# Altium project MADI_STM32G4_PCB.PrjPcb
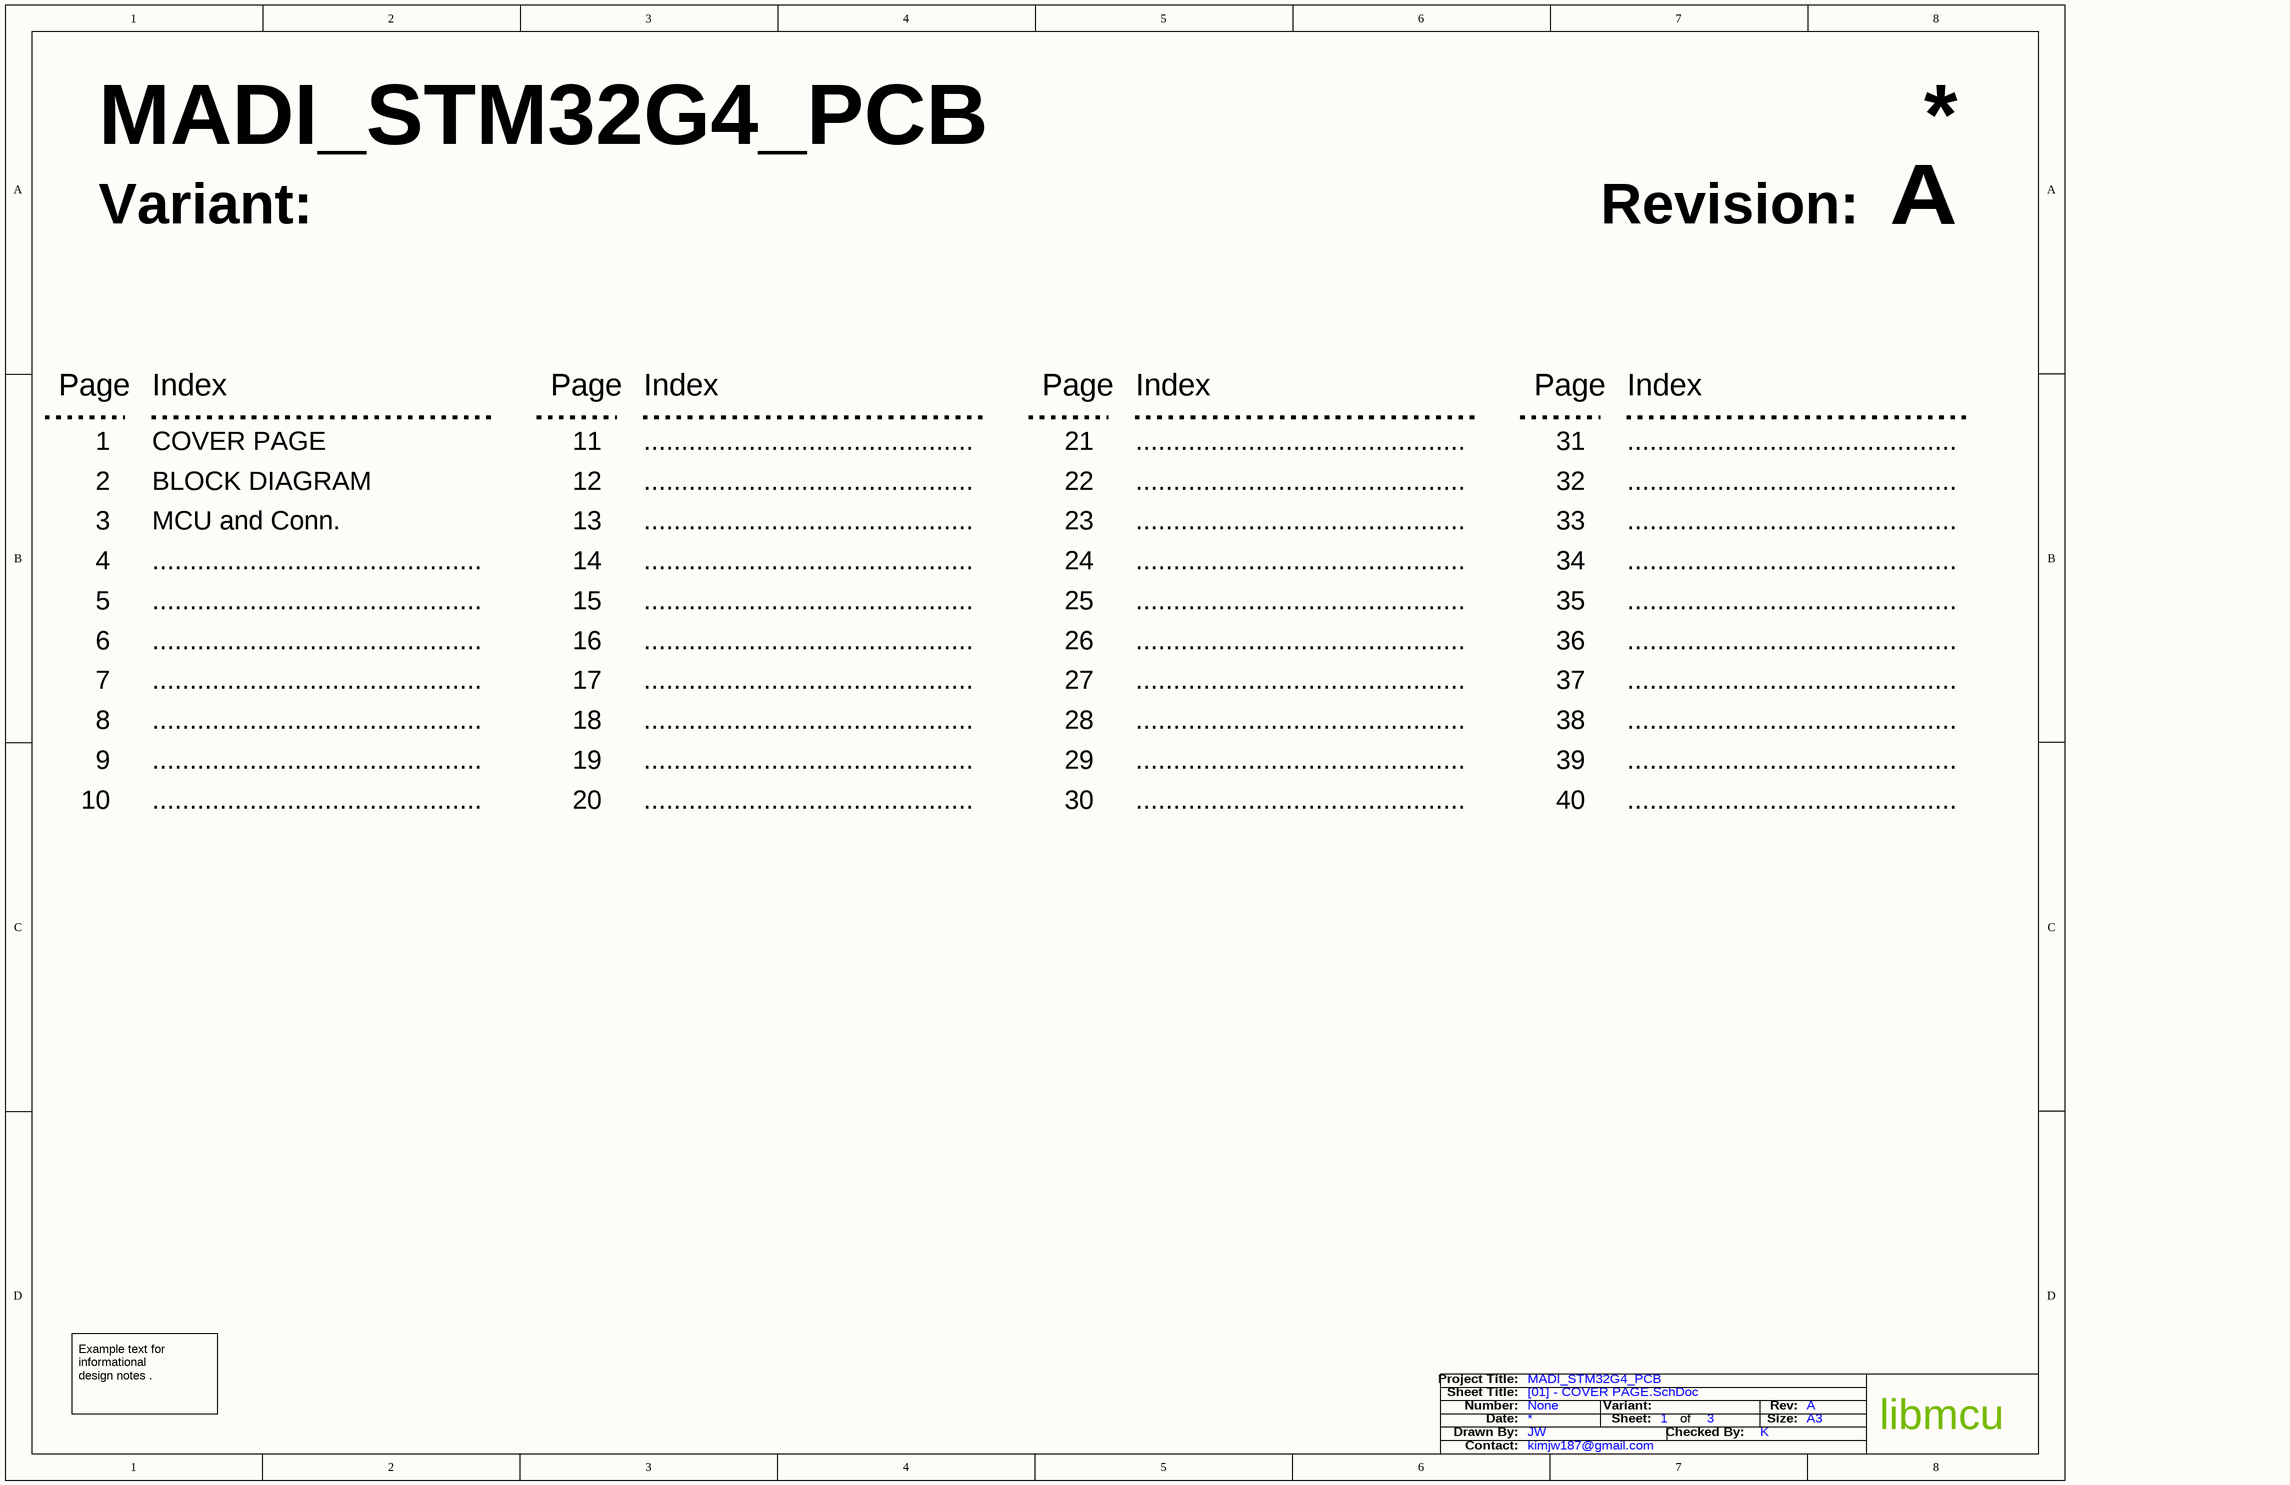
[diagram p0: [01] - COVER PAGE.SchDoc]
VersionRevision: A; SheetSize: A3; ProjectNumber: None; Project: MADI_STM32G4_PCB; DrawnBy: JW; Contact: kimjw187@gmail.com; Company: libmcu; CheckedBy: K; Address2: -; Address1: -
3 sheets, 52 parts. Net scope: global (net labels, ports and power ports of the same name join across sheets).
Board file: MADI_STM32G4_PCB_L4.PcbDoc
Sheets:
  [01] - COVER PAGE.SchDoc
  [02] - BLOCK DIAGRAM.SchDoc
  [03] - MCU and Conn.SchDoc

## Sheet [01] - COVER PAGE.SchDoc
size A3; DocumentNumber: 1; SheetNumber: 1; SheetTotal: 3

### Notes on the sheet
- Variant:
- Revision:
- Page
- Index
- 1
- 2
- COVER PAGE
- BLOCK DIAGRAM
- 11
- 12
- ............................................
- 21
- 22
- 31
- 32
- 3
- 4
- MCU and Conn.
- 13
- 14
- 23
- 24
- 33
- 34
- 5
- 15
- 25
- 35
- 6
- 7
- 16
- 17
- 26
- 27
- 36
- 37
- 8
- 9
- 18
- 19
- 28
- 29
- 38
- 39
- 10
- 20
- 30
- 40
- Example text for informational
  design notes .
- Project Title:
- Number:
- Date:
- Sheet Title:
- Drawn By:
- Sheet:
- of
- Checked By:
- Rev:
- Size:
- libmcu
- Contact:

## Sheet [02] - BLOCK DIAGRAM.SchDoc
size A3; DocumentNumber: 2; SheetNumber: 2; SheetTotal: 3

### Notes on the sheet
- Project Title:
- Number:
- Date:
- Sheet Title:
- Drawn By:
- Sheet:
- Variant:
- of
- Checked By:
- Rev:
- Size:
- libmcu
- Contact:
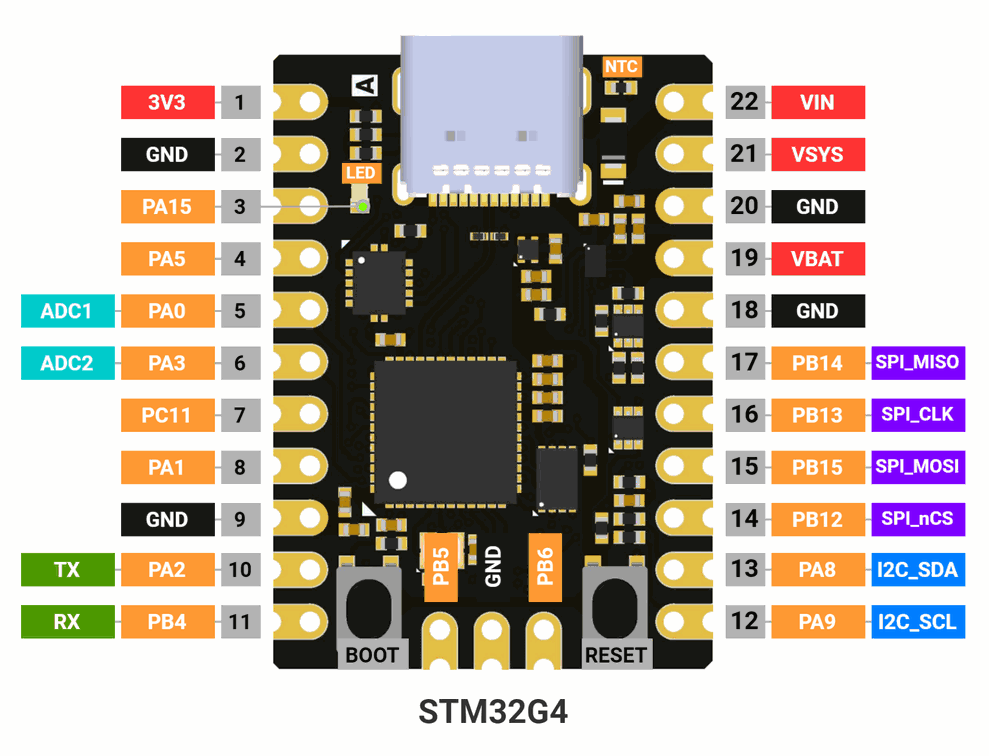
[diagram p1: [02] - BLOCK DIAGRAM.SchDoc]

## Sheet [03] - MCU and Conn.SchDoc
size A3; DocumentNumber: 3; SheetNumber: 3; SheetTotal: 3
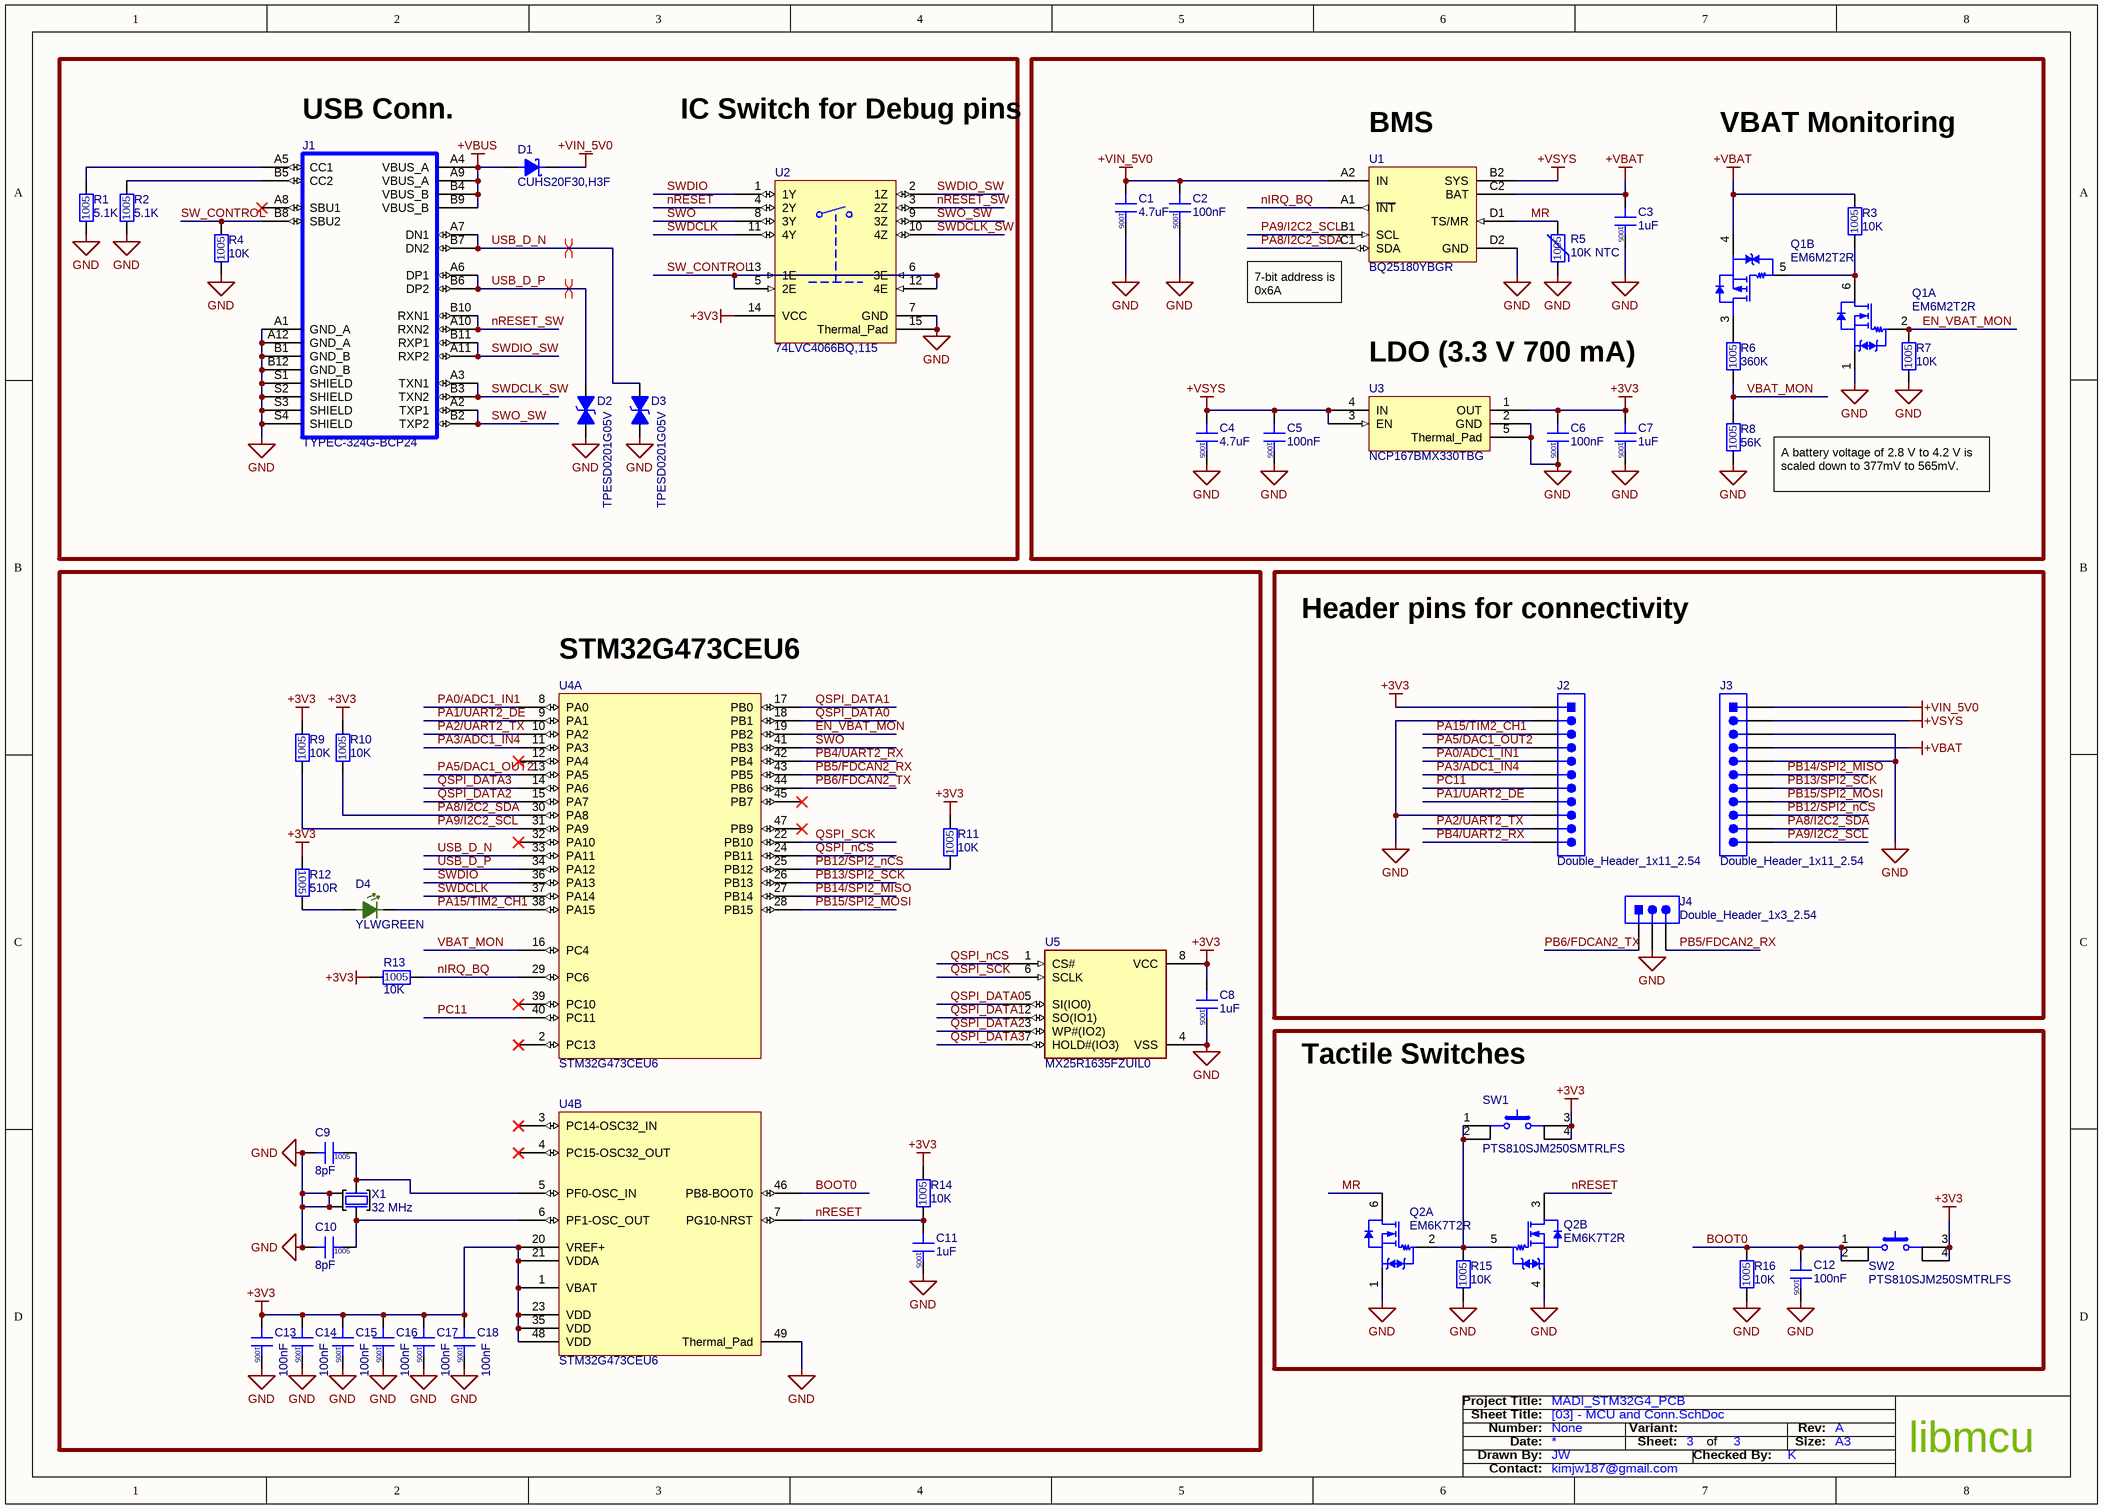
[diagram p2: [03] - MCU and Conn.SchDoc]

### Parts
C1  4.7uF  [CAPC1005X06N]
C2  100nF  [CAPC1005X06N]
C3  1uF  [CAPC1005X06N]
C4  4.7uF  [CAPC1005X06N]
C5  100nF  [CAPC1005X06N]
C6  100nF  [CAPC1005X06N]
C7  1uF  [CAPC1005X06N]
C8  1uF  [CAPC1005X06N]
C9  8pF  [CAPC1005X06N]
C10  8pF  [CAPC1005X06N]
C11  1uF  [CAPC1005X06N]
C12  100nF  [CAPC1005X06N]
C13  100nF  [CAPC1005X06N]
C14  100nF  [CAPC1005X06N]
C15  100nF  [CAPC1005X06N]
C16  100nF  [CAPC1005X06N]
C17  100nF  [CAPC1005X06N]
C18  100nF  [CAPC1005X06N]
D1  CUHS20F30,H3F  [US2H-DIODE]
D2  TPESD0201G05V  [DIOC0603X03N]
D3  TPESD0201G05V  [DIOC0603X03N]
D4  YLWGREEN  [LDIOC1608X08N]
J1  TYPEC-324G-BCP24  [KUSBX-SMT3-CS-BTR_KYC]
J2  Double_Header_1x11_2.54  [1x11_DOUBLE_HEADER_2.54]  (no BOM)
J3  Double_Header_1x11_2.54  [1x11_DOUBLE_HEADER_2.54]  (no BOM)
J4  Double_Header_1x3_2.54  [1x3_DOUBLE_HEADER_2.54]  (no BOM)
Q1  EM6M2T2R  [SOTFL50P160X55-6N]  (parts A,B of 2)
Q2  EM6K7T2R  [SOTFL50P160X55-6N]  (parts A,B of 2)
R1  5.1K  [RESC1005X04N]
R2  5.1K  [RESC1005X04N]
R3  10K  [RESC1005X04N]
R4  10K  [RESC1005X04N]
R5  10K NTC  [NTC1005X05N]
R6  360K  [RESC1005X04N]
R7  10K  [RESC1005X04N]
R8  56K  [RESC1005X04N]
R9  10K  [RESC1005X04N]
R10  10K  [RESC1005X04N]
R11  10K  [RESC1005X04N]
R12  510R  [RESC1005X04N]
R13  10K  [RESC1005X04N]
R14  10K  [RESC1005X04N]
R15  10K  [RESC1005X04N]
R16  10K  [RESC1005X04N]
SW1  PTS810SJM250SMTRLFS  [PTS810]
SW2  PTS810SJM250SMTRLFS  [PTS810]
U1  BQ25180YBGR  [BGA8C40P2X4_100X155X50_YBG0008]
U2  74LVC4066BQ,115  [QFN50P250X300X100_HS-15N]
U3  NCP167BMX330TBG  [NCP167]
U4  STM32G473CEU6  [QFN50P700X700X60_HS-49N]  (parts A,B of 2)
U5  MX25R1635FZUIL0  [USON8_3X2]
X1  32 MHz  [XT2016_ECS]

### Blocks framed on the sheet
STM32G473CEU6: C8-C11 C13-C18 D4 R9-R14 U4 U5 X1
Header pins for connectivity: J2-J4
Tactile Switches: C12 Q2 R15 R16 SW1 SW2

### Nets
+3V3: C6.2 C7.2 C8.2 C13.2 C14.2 C15.2 C16.2 C17.2 C18.2 J2.1 R9.2 R10.2 R11.2 R12.2 R13.1 R14.2 SW1.3 SW1.4 SW2.3 SW2.4 U2.14(VCC) U3.1(OUT) U4.1(VBAT) U4.20(VREF+) U4.21(VDDA) U4.23(VDD) U4.35(VDD) U4.48(VDD) U5.8(VCC)
+VBAT: C3.2 J3.4 Q1.4(S) R3.2 U1.C2(BAT)
+VBUS: D1.2(Anode) J1.A4(VBUS_A) J1.A9(VBUS_A) J1.B4(VBUS_B) J1.B9(VBUS_B)
+VIN_5V0: C1.2 C2.2 D1.1(Cathode) J3.1 U1.A2(IN)
+VSYS: C4.2 C5.2 J3.2 U1.B2(SYS) U3.3(EN) U3.4(IN)
GND: C1.1 C2.1 C3.1 C4.1 C5.1 C6.1 C7.1 C8.1 C9.2 C10.2 C11.1 C12.1 C13.1 C14.1 C15.1 C16.1 C17.1 C18.1 D2.2 D3.2 J1.A1(GND_A) J1.A12(GND_A) J1.B1(GND_B) J1.B12(GND_B) J1.S1(SHIELD) J1.S2(SHIELD) J1.S3(SHIELD) J1.S4(SHIELD) J2.2 J2.9 J3.3 J3.5 J4.2 Q1.1(S) Q2.1(S) Q2.4(S) R1.1 R2.1 R4.1 R5.1 R7.1 R8.1 R15.1 R16.1 U1.D2(GND) U2.7(GND) U2.15(Thermal_Pad) U3.2(GND) U3.5(Thermal_Pad) U4.49(Thermal_Pad) U5.4(VSS) X1.2(GND) X1.4(GND)
BOOT0: C12.2 R16.2 SW2.1 SW2.2 U4.46(PB8-BOOT0)
EN_VBAT_MON: Q1.2(G) R7.2 U4.19(PB2)
MR: Q2.6(D) R5.2 U1.D1(TS/MR)
nIRQ_BQ: R13.2 U1.A1(~{INT}) U4.29(PC6)
nRESET: C11.2 Q2.3(D) R14.1 U2.4(2Y) U4.7(PG10-NRST)
nRESET_SW: J1.A10(RXN2) J1.B10(RXN1) U2.3(2Z)
PA0/ADC1_IN1: J2.5 U4.8(PA0)
PA1/UART2_DE: J2.8 U4.9(PA1)
PA2/UART2_TX: J2.10 U4.10(PA2)
PA3/ADC1_IN4: J2.6 U4.11(PA3)
PA5/DAC1_OUT2: J2.4 U4.13(PA5)
PA8/I2C2_SDA: J3.10 R10.1 U1.C1(SDA) U4.30(PA8)
PA9/I2C2_SCL: J3.11 R9.1 U1.B1(SCL) U4.31(PA9)
PA15/TIM2_CH1: D4.K J2.3 U4.38(PA15)
PB4/UART2_RX: J2.11 U4.42(PB4)
PB5/FDCAN2_RX: J4.3 U4.43(PB5)
PB6/FDCAN2_TX: J4.1 U4.44(PB6)
PB12/SPI2_nCS: J3.9 R11.1 U4.25(PB12)
PB13/SPI2_SCK: J3.7 U4.26(PB13)
PB14/SPI2_MISO: J3.6 U4.27(PB14)
PB15/SPI2_MOSI: J3.8 U4.28(PB15)
PC11: J2.7 U4.40(PC11)
QSPI_DATA0: U4.18(PB1) U5.5(SI(IO0))
QSPI_DATA1: U4.17(PB0) U5.2(SO(IO1))
QSPI_DATA2: U4.15(PA7) U5.3(WP#(IO2))
QSPI_DATA3: U4.14(PA6) U5.7(HOLD#(IO3))
QSPI_nCS: U4.24(PB11) U5.1(CS#)
QSPI_SCK: U4.22(PB10) U5.6(SCLK)
SW_CONTROL: J1.B8(SBU2) R4.2 U2.5(2E) U2.6(3E) U2.12(4E) U2.13(1E)
SWDCLK: U2.11(4Y) U4.37(PA14)
SWDCLK_SW: J1.A3(TXN1) J1.B3(TXN2) U2.10(4Z)
SWDIO: U2.1(1Y) U4.36(PA13)
SWDIO_SW: J1.A11(RXP2) J1.B11(RXP1) U2.2(1Z)
SWO: U2.8(3Y) U4.41(PB3)
SWO_SW: J1.A2(TXP1) J1.B2(TXP2) U2.9(3Z)
USB_D_N: D3.1 J1.A7(DN1) J1.B7(DN2) U4.33(PA11)
USB_D_P: D2.1 J1.A6(DP1) J1.B6(DP2) U4.34(PA12)
VBAT_MON: R6.1 R8.2 U4.16(PC4)
NetC9_1: C9.1 U4.5(PF0-OSC_IN) X1.1(IN)
NetC10_1: C10.1 U4.6(PF1-OSC_OUT) X1.3(OUT)
NetD4_A: D4.A R12.1
NetJ1_A5: J1.A5(CC1) R1.2
NetJ1_B5: J1.B5(CC2) R2.2
NetQ1_3: Q1.3(D) R6.2
NetQ1_5: Q1.5(G) Q1.6(D) R3.1
NetQ2_2: Q2.2(G) Q2.5(G) R15.2 SW1.1 SW1.2

Not connected (* = marked no-connect by the designer): J1 A8(SBU1)*; U4 2(PC13)* 3(PC14-OSC32_IN)* 4(PC15-OSC32_OUT)* 12(PA4)* 32(PA10)* 39(PC10)* 45(PB7)* 47(PB9)*

### Layout directives
differential pair; differential pair class DIFF90: USB_D_N, USB_D_P

### Notes on the sheet
- (near J1) USB Conn.
- IC Switch for Debug pins
- (near U1) BMS
- VBAT Monitoring
- (near U1) 7-bit address is 0x6A
- LDO (3.3 V 700 mA)
- (near R8) A battery voltage of 2.8 V to 4.2 V is scaled down to 377mV to 565mV.
- Project Title:
- Number:
- Date:
- Sheet Title:
- Drawn By:
- Sheet:
- Variant:
- of
- Checked By:
- Rev:
- Size:
- libmcu
- Contact:

### Library data of the parts
C1 C4 = CL05A475MP5NRNC: CAP CER 4.7UF 10V X5R 0402; Manufacturer: Samsung; Tolerance: 20%; Supplier 1: Digi-Key; Supplier Part Number 1: 1276-1482-1-ND; Manufacturer Part Number: CL05A475MP5NRNC; RoHS: Yes; Category: Ceramic Capacitors; Stock 1: 6997940; Pricing 1: 1=0.10000, 10=0.06800, 50=0.03680, 100=0.03010, 500=0.02150, 1000=0.01689, 2500=0.01535, 5000=0.01412 (USD); Mount: Surface Mount; Case/Package: 0402; Case Code (Metric): 1005; Case Code (Imperial): 0402; Min Operating Temperature: -55°C; Max Operating Temperature: 85°C; Package Quantity: 10000; Packaging: Tape and Reel; Capacitance: 4.7uF; Voltage Rating: 10V; Dielectric: X5R; Series: CL; Length: 0.039inch; Width: 0.02inch; Thickness: 0.022inch; Lead Free: Lead Free; RoHS Compliant: Yes; ComponentLink1URL: https://datasheet.ciiva.com/25786/cl05a475mp5nrnc-25786963.pdf?src-supplier=Digi-Key; ComponentLink1Description: https://datasheet.ciiva.com/25786/cl05a475mp5nrnc-25786963.pdf?src-supplier=Digi-Key; ComponentLink2URL: https://datasheet.ciiva.com/16437/cl05b104kq5nnnc-16437353.pdf?src-supplier=Future+Electronics; ComponentLink2Description: https://datasheet.ciiva.com/16437/cl05b104kq5nnnc-16437353.pdf?src-supplier=Future+Electronics
C2 C5 C6 C12-C18 = GRM155R71H104KE14D: CAP CER 0.1UF 50V X7R 0402; Manufacturer: Murata; Material: Ceramic; Tolerance: 10%; Dissipation Factor: 0.025%; Supplier 1: Digi-Key; Supplier Part Number 1: 490-10700-1-ND; Manufacturer Part Number: GRM155R71H104KE14D; RoHS: Yes; Category: Ceramic Capacitors; Stock 1: 23318607; Pricing 1: 1=0.10000, 10=0.03400, 50=0.01860, 100=0.01520, 500=0.01086, 1000=0.00854, 2500=0.00776, 5000=0.00714 (USD); Mount: Surface Mount; Case/Package: 0402; Case Code (Metric): 1005; Case Code (Imperial): 0402; Weight: 0.000212oz; Dielectric Material: Ceramic; Min Operating Temperature: -55°C; Max Operating Temperature: 125°C; Packaging: Tape and Reel; Dielectric: X7R; Capacitance: 100nF; Voltage Rating: 50V; Termination: SMD/SMT; Voltage: 50V; Resistor Type: Ceramic; Voltage Rating (DC): 50V; Package Quantity: 10000; Length: 1mm; Width: 0.5mm; Height: 0.5mm; Thickness: 0.022inch; Depth: 0.5mm; REACH SVHC: No SVHC; Lead Free: Lead Free; RoHS Compliant: Yes; ComponentLink1URL: http://www.mouser.com/ds/2/281/c02e-2905.pdf?src-supplier=Mouser; ComponentLink1Description: http://www.mouser.com/ds/2/281/c02e-2905.pdf?src-supplier=Mouser; ComponentLink2URL: http://www.farnell.com/datasheets/2079156.pdf?src-supplier=Farnell; ComponentLink2Description: http://www.farnell.com/datasheets/2079156.pdf?src-supplier=Farnell; ComponentLink3URL: http://components.arrow.com/part/dataview/0323_07030614?src-supplier=Arrow+Europe; ComponentLink3Description: http://components.arrow.com/part/dataview/0323_07030614?src-supplier=Arrow+Europe; ComponentLink4URL: http://psearch.en.murata.com/capacitor/product/GRM155R71H104KE14%23.pdf?src-supplier=Avnet; ComponentLink4Description: http://psearch.en.murata.com/capacitor/product/GRM155R71H104KE14%23.pdf?src-supplier=Avnet; ComponentLink5URL: https://search.murata.co.jp/Ceramy/image/img/A01X/G101/ENG/GRM155R71H104KE14-01.pdf?src-supplier=Digi-Key; ComponentLink5Description: https://search.murata.co.jp/Ceramy/image/img/A01X/G101/ENG/GRM155R71H104KE14-01.pdf?src-supplier=Digi-Key; ComponentLink6URL: http://www.farnell.com/datasheets/2079156.pdf?src-supplier=Newark; ComponentLink6Description: http://www.farnell.com/datasheets/2079156.pdf?src-supplier=Newark; ComponentLink7URL: http://www.farnell.com/datasheets/2079156.pdf?src-supplier=Element14; ComponentLink7Description: http://www.farnell.com/datasheets/2079156.pdf?src-supplier=Element14
C3 C7 C8 C11 = CL05A105KO5NNNC: CAP CER 1UF 16V X5R 0402; Manufacturer: Samsung; Tolerance: 10%; Supplier 1: Digi-Key; Supplier Part Number 1: 1276-1067-1-ND; Manufacturer Part Number: CL05A105KO5NNNC; RoHS: Yes; Category: Ceramic Capacitors; Stock 1: 2455652; Pricing 1: 1=0.10000, 10=0.04400, 50=0.02400, 100=0.01960, 500=0.01402, 1000=0.01101, 2500=0.01001, 5000=0.00921 (USD); Mount: Surface Mount; Case/Package: 0402; Contact Plating: Tin; Case Code (Imperial): 0402; Case Code (Metric): 1005; Min Operating Temperature: -55°C; Max Operating Temperature: 85°C; Capacitance: 1uF; Dielectric: X5R; Packaging: Tape and Reel; Package Quantity: 1; Voltage Rating: 16V; Voltage: 16V; Length: 1mm; Width: 0.02inch; Height: 0.5mm; Thickness: 0.022inch; Depth: 0.5mm; Radiation Hardening: No; ComponentLink1URL: https://datasheet.ciiva.com/16207/cl05a105ko5nnnc-16207571.pdf?src-supplier=Future+Electronics; ComponentLink1Description: https://datasheet.ciiva.com/16207/cl05a105ko5nnnc-16207571.pdf?src-supplier=Future+Electronics; ComponentLink2URL: https://datasheet.ciiva.com/15195/getdatasheetpartid-355272-15195629.pdf?src-supplier=Verical; ComponentLink2Description: https://datasheet.ciiva.com/15195/getdatasheetpartid-355272-15195629.pdf?src-supplier=Verical
C9 C10 = GRM1555C1H8R0DA01D: CAP CER 8PF 50V C0G/NP0 0402; Manufacturer: Murata; Material: Ceramic; Dielectric: C0G; Temperature Coefficient: 30ppm/°C; Supplier 1: Digi-Key; Supplier Part Number 1: 490-5867-1-ND; Manufacturer Part Number: GRM1555C1H8R0DA01D; RoHS: Yes; Category: Ceramic Capacitors; Stock 1: 709625; Pricing 1: 1=0.10000, 10=0.03400, 50=0.01840, 100=0.01510, 500=0.01078, 1000=0.00847, 2500=0.00770, 5000=0.00708 (USD); Mount: Surface Mount; Case/Package: 0402; Case Code (Imperial): 0402; Case Code (Metric): 1005; Min Operating Temperature: -55°C; Max Operating Temperature: 125°C; Capacitance: 8pF; Voltage Rating: 50V; Voltage Rating (DC): 50V; Packaging: Tape and Reel; Package Quantity: 1; Termination: SMD/SMT; Voltage: 50V; Series: GRM; Construction: Flat; Length: 1mm; Width: 0.5mm; Height: 0.5mm; Thickness: 0.022inch; Depth: 0.5mm; Radiation Hardening: No; Reach SVHC Compliant: Yes; Lead Free: Lead Free; RoHS Compliant: Yes; ComponentLink1URL: https://datasheet.ciiva.com/5420/product-5420945.pdf?src-supplier=Mouser; ComponentLink1Description: https://datasheet.ciiva.com/5420/product-5420945.pdf?src-supplier=Mouser; ComponentLink2URL: https://datasheet.ciiva.com/18184/getdatasheetpartid-713257-18184503.pdf?src-supplier=Verical; ComponentLink2Description: https://datasheet.ciiva.com/18184/getdatasheetpartid-713257-18184503.pdf?src-supplier=Verical; ComponentLink3URL: https://datasheet.ciiva.com/6277/partnumbering-e-01-6277815.pdf?src-supplier=Digi-Key; ComponentLink3Description: https://datasheet.ciiva.com/6277/partnumbering-e-01-6277815.pdf?src-supplier=Digi-Key; ComponentLink4URL: https://datasheet.ciiva.com/6277/partnumbering-e-01-6277814.pdf?src-supplier=Digi-Key; ComponentLink4Description: https://datasheet.ciiva.com/6277/partnumbering-e-01-6277814.pdf?src-supplier=Digi-Key; ComponentLink5URL: https://datasheet.ciiva.com/6277/partnumbering-e-01-6277816.pdf?src-supplier=Digi-Key; ComponentLink5Description: https://datasheet.ciiva.com/6277/partnumbering-e-01-6277816.pdf?src-supplier=Digi-Key; ComponentLink6URL: https://datasheet.ciiva.com/11463/product-11463855.pdf?src-supplier=Avnet; ComponentLink6Description: https://datasheet.ciiva.com/11463/product-11463855.pdf?src-supplier=Avnet
D1 = CUHS20F30,H3F: DIODE SCHOTTKY 30V 2A US2H; Manufacturer: Toshiba; Supplier 1: Digi-Key; Supplier Part Number 1: CUHS20F30H3FCT-ND; Manufacturer Part Number: CUHS20F30,H3F; RoHS: No; Stock 1: 70970; Pricing 1: 1=0.37000, 10=0.30200, 100=0.20540, 500=0.15408, 1000=0.11556 (USD)
D2 D3 = TPESD0201G05V: TVS DIODE 5.5VWM 40VC 0201; Manufacturer: TECH PUBLIC; Number of Bidirectional Channels: 1; Reverse Standoff Voltage: 5.5V; Clamping Voltage: 40V; Power Line Protection: No; Peak Pulse Current: 3A; Manufacturer Part Number: TPESD0201G05V; RoHS: Yes; Category: Diodes; Mount: Surface Mount; Case/Package: SMD/SMT; Min Operating Temperature: -55°C; Max Operating Temperature: 125°C; Packaging: Tape and Reel; Resistor Type: Zener; Lead Free: Lead Free; Halogen Free: Halogen Free; RoHS Compliant: Yes; ComponentLink1Description: https://datasheet.lcsc.com/lcsc/2005211235_TECH-PUBLIC-TPESD0201G15V_C558460.pdf; ComponentLink1URL: https://datasheet.lcsc.com/lcsc/2005211235_TECH-PUBLIC-TPESD0201G15V_C558460.pdf
D4 = 19-217/G7C-AN1P2/3T: LED YLW/GREEN DIFFUSED 1608 SMD; Manufacturer: Everlight; Color: Green,Yellow; Forward Voltage: 2V; Lens Style: Clear,Diffused,Colorless,Rectangular; Viewing Angle: 120°; Number of LEDs: 1; Supplier 1: Win Source Electronics; Supplier Part Number 1: 5203-19-217/G7C-AN1P2/3T; Manufacturer Part Number: 19-217/G7C-AN1P2/3T; RoHS: Yes; Category: LEDs; Stock 1: 152500; Pricing 1: 2635=0.01900, 6250=0.01600, 10000=0.01500, 13335=0.01500, 17860=0.01400, 23080=0.01300 (USD); Mounting Technology: Surface Mount; Pins: 2; Lead Free: Lead Free; RoHS Compliant: Yes; ComponentLink1URL: https://datasheet.ciiva.com/48679/19-217-g7c-an1p2-3t-48679179.pdf?src-supplier=Avnet; ComponentLink1Description: https://datasheet.ciiva.com/48679/19-217-g7c-an1p2-3t-48679179.pdf?src-supplier=Avnet
J1 = TYPEC-324G-BCP24: CONN RCPT USB TYPE C, SMT PINS, TH SHIELD; Manufacturer: XUNPU; Manufacturer Part Number: TYPEC-324G-BCP24; Category: USB Connectors; ComponentLink1Description: https://www.lcsc.com/product-detail/USB-Connectors_XUNPU-TYPEC-324G-BCP24_C920230.html; ComponentLink1URL: https://www.lcsc.com/product-detail/USB-Connectors_XUNPU-TYPEC-324G-BCP24_C920230.html
Q1 = EM6M2T2R: MOSFET N/P-CH 20V 0.2A EMT6; Manufacturer: Rohm; Continuous Drain Current (ID): 200mA; Rds On Max: 1R; Input Capacitance: 25pF; Max Power Dissipation: 150mW; FET Type: N and P-Channel; Supplier 1: Digi-Key; Supplier Part Number 1: EM6M2T2RCT-ND; Manufacturer Part Number: EM6M2T2R; RoHS: Yes; Category: MOSFETs; Stock 1: 90900; Pricing 1: 1=0.58000, 10=0.49600, 100=0.37030, 500=0.29096, 1000=0.22482, 2000=0.20499 (USD); Mounting Technology: Surface Mount; Case/Package: SOT-23-5; Pins: 6; Min Operating Temperature: -55°C; Max Operating Temperature: 150°C; Packaging: Tape and Reel; Package Quantity: 1; Drain to Source Voltage (Vdss): 20V; Drain to Source Resistance: 1R; Drain-source On Resistance-Max: 1R; Radiation Hardening: No; Lead Free: Lead Free; RoHS Compliant: Yes; ComponentLink1URL: https://datasheet.ciiva.com/6387/em6m2-6387413.pdf?src-supplier=Digi-Key; ComponentLink1Description: https://datasheet.ciiva.com/6387/em6m2-6387413.pdf?src-supplier=Digi-Key; ComponentLink2URL: https://datasheet.ciiva.com/6387/em6m2-6387415.pdf?src-supplier=Digi-Key; ComponentLink2Description: https://datasheet.ciiva.com/6387/em6m2-6387415.pdf?src-supplier=Digi-Key; ComponentLink3URL: https://datasheet.ciiva.com/6387/em6m2-6387417.pdf?src-supplier=Digi-Key; ComponentLink3Description: https://datasheet.ciiva.com/6387/em6m2-6387417.pdf?src-supplier=Digi-Key
Q2 = EM6K7T2R: MOSFET 2N-CH 20V 0.2A EMT6; Manufacturer: Rohm; Rise Time: 10ns; Rds On Max: 1.2R; Input Capacitance: 25pF; Continuous Drain Current (ID): 200mA; Max Power Dissipation: 150mW; Turn-On Delay Time: 5ns; Turn-Off Delay Time: 15ns; Gate to Source Voltage (Vgs): 8V; FET Type: 2 N-Channel; Supplier 1: Digi-Key; Supplier Part Number 1: EM6K7T2RCT-ND; Manufacturer Part Number: EM6K7T2R; RoHS: Yes; Category: MOSFETs; Stock 1: 15154; Pricing 1: 1=0.54000, 10=0.43900, 100=0.29900, 500=0.22428, 1000=0.16821, 2000=0.15419 (USD); Mounting Technology: Surface Mount; Pins: 6; Min Operating Temperature: -55°C; Max Operating Temperature: 150°C; Package Quantity: 8000; Packaging: Tape and Reel; Drain to Source Voltage (Vdss): 20V; Fall Time: 10ns; Drain to Source Resistance: 1.2R; Drain-source On Resistance-Max: 1.2R; Radiation Hardening: No; Lead Free: Lead Free; RoHS Compliant: Yes; ComponentLink1URL: https://datasheet.ciiva.com/6387/em6k7-6387446.pdf?src-supplier=Digi-Key; ComponentLink1Description: https://datasheet.ciiva.com/6387/em6k7-6387446.pdf?src-supplier=Digi-Key; ComponentLink2URL: https://datasheet.ciiva.com/13051/em6k7-209726-13051863.pdf?src-supplier=Mouser; ComponentLink2Description: https://datasheet.ciiva.com/13051/em6k7-209726-13051863.pdf?src-supplier=Mouser; ComponentLink3URL: https://datasheet.ciiva.com/11162/em6k7-11162107.pdf?src-supplier=Avnet; ComponentLink3Description: https://datasheet.ciiva.com/11162/em6k7-11162107.pdf?src-supplier=Avnet; ComponentLink4URL: https://datasheet.ciiva.com/6387/em6k7-6387451.pdf?src-supplier=Digi-Key; ComponentLink4Description: https://datasheet.ciiva.com/6387/em6k7-6387451.pdf?src-supplier=Digi-Key; ComponentLink5URL: https://datasheet.ciiva.com/16437/em6k7-16437677.pdf?src-supplier=Future+Electronics; ComponentLink5Description: https://datasheet.ciiva.com/16437/em6k7-16437677.pdf?src-supplier=Future+Electronics
R1 R2 = RC0402FR-075K1L: RES SMD 5.1K OHM 1% 1/16W 0402; Manufacturer: Yageo; Power Rating: 63mW; Resistance: 5.1kR; Temperature Coefficient: 100ppm/°C; Voltage Rating: 50V; Supplier 1: Digi-Key; Supplier Part Number 1: 311-5.10KLRCT-ND; Manufacturer Part Number: RC0402FR-075K1L; RoHS: Yes; Category: Chip SMD Resistors; Stock 1: 1329359; Pricing 1: 1=0.10000, 10=0.01600, 100=0.00660, 1000=0.00299, 2500=0.00259, 5000=0.00214 (USD); Case/Package: 0402; Case Code (Metric): 1005; Case Code (Imperial): 0402; Min Operating Temperature: -55°C; Max Operating Temperature: 155°C; Tolerance: 1%; Technology: THICK FILM; Packaging: Tape and Reel; Package Quantity: 1; Resistor Type: Thick Film; Number of Terminations: 2; Termination: SMD/SMT; Max Power Dissipation: 63mW; Voltage Rating (DC): 50V; Working Voltage: 50V; Features: Moisture Resistant; Series: RC; Resistance Tolerance: 1%; Construction: Rectangular; Length: 1mm; Width: 0.02inch; Height: 0.016inch; Depth: 0.5mm; RoHS Compliant: Yes; REACH SVHC: Unknown; Military Standard: Not; Lead Free: Lead Free; ComponentLink1URL: https://datasheet.ciiva.com/2453/pyu-r-int-thick-7-2453400.pdf?src-supplier=Digi-Key; ComponentLink1Description: https://datasheet.ciiva.com/2453/pyu-r-int-thick-7-2453400.pdf?src-supplier=Digi-Key; ComponentLink2URL: https://datasheet.ciiva.com/2453/pyu-r-int-thick-7-2453401.pdf?src-supplier=Digi-Key; ComponentLink2Description: https://datasheet.ciiva.com/2453/pyu-r-int-thick-7-2453401.pdf?src-supplier=Digi-Key; ComponentLink3URL: https://datasheet.ciiva.com/2453/pyu-r-int-thick-7-2453402.pdf?src-supplier=Digi-Key; ComponentLink3Description: https://datasheet.ciiva.com/2453/pyu-r-int-thick-7-2453402.pdf?src-supplier=Digi-Key; ComponentLink4URL: https://datasheet.ciiva.com/12558/pyu-rc0402-51-rohs-l-6-r-8721-12558460.pdf?src-supplier=Mouser; ComponentLink4Description: https://datasheet.ciiva.com/12558/pyu-rc0402-51-rohs-l-6-r-8721-12558460.pdf?src-supplier=Mouser; ComponentLink5URL: https://datasheet.ciiva.com/16744/pyu-rc0402-51-rohs-l-6-r-16744283.pdf?src-supplier=Future+Electronics; ComponentLink5Description: https://datasheet.ciiva.com/16744/pyu-rc0402-51-rohs-l-6-r-16744283.pdf?src-supplier=Future+Electronics; ComponentLink6URL: https://datasheet.ciiva.com/15189/getdatasheetpartid-323636-15189493.pdf?src-supplier=Verical; ComponentLink6Description: https://datasheet.ciiva.com/15189/getdatasheetpartid-323636-15189493.pdf?src-supplier=Verical; ComponentLink7URL: https://datasheet.ciiva.com/7983/1018594-7983519.pdf?src-supplier=Element14; ComponentLink7Description: https://datasheet.ciiva.com/7983/1018594-7983519.pdf?src-supplier=Element14; ComponentLink8URL: https://datasheet.ciiva.com/46394/1018594-46394936.pdf?src-supplier=Element14; ComponentLink8Description: https://datasheet.ciiva.com/46394/1018594-46394936.pdf?src-supplier=Element14
R3 R4 R7 R9-R11 R13-R16 = RC0402FR-0710KL: RES SMD 10K OHM 1% 1/16W 0402; Manufacturer: Yageo; Resistance: 10kR; Temperature Coefficient: 100ppm/°C; Voltage Rating (DC): 50V; Power Rating: 62.5mW; Max Power Dissipation: 63mW; Supplier 1: Digi-Key; Supplier Part Number 1: 311-10.0KLRCT-ND; Manufacturer Part Number: RC0402FR-0710KL; RoHS: Yes; Category: Chip SMD Resistors; Stock 1: 39209283; Pricing 1: 1=0.10000, 10=0.01400, 100=0.00580, 1000=0.00260, 2500=0.00226, 5000=0.00186 (USD); Case/Package: 0402; Number of Pins: 2; Case Code (Imperial): 0402; Case Code (Metric): 1005; Min Operating Temperature: -55°C; Max Operating Temperature: 155°C; Resistor Type: Thick Film; Tolerance: 1%; Packaging: Tape and Reel; Voltage Rating: 50V; Termination: SMD/SMT; Working Voltage: 50V; Number of Terminations: 2; Features: Moisture Resistant; Series: RC; Resistance Tolerance: 1%; Construction: Rectangular; Length: 1mm; Width: 0.5mm; Height: 0.32mm; Depth: 0.5mm; Lead Pitch: 0.2mm; REACH SVHC: No SVHC; Lead Free: Lead Free; RoHS Compliant: Yes; Military Standard: Not; ComponentLink1URL: https://datasheet.ciiva.com/7660/38568-7660787.pdf?src-supplier=Element14; ComponentLink1Description: https://datasheet.ciiva.com/7660/38568-7660787.pdf?src-supplier=Element14; ComponentLink2URL: https://datasheet.ciiva.com/7983/1018594-7983486.pdf?src-supplier=Element14; ComponentLink2Description: https://datasheet.ciiva.com/7983/1018594-7983486.pdf?src-supplier=Element14; ComponentLink3URL: https://datasheet.ciiva.com/7849/1784430-7849813.pdf?src-supplier=Element14; ComponentLink3Description: https://datasheet.ciiva.com/7849/1784430-7849813.pdf?src-supplier=Element14; ComponentLink4URL: https://datasheet.ciiva.com/7849/1686128-7849814.pdf?src-supplier=Element14; ComponentLink4Description: https://datasheet.ciiva.com/7849/1686128-7849814.pdf?src-supplier=Element14; ComponentLink5URL: https://datasheet.ciiva.com/7849/1784430-7849815.pdf?src-supplier=Element14; ComponentLink5Description: https://datasheet.ciiva.com/7849/1784430-7849815.pdf?src-supplier=Element14; ComponentLink6URL: https://datasheet.ciiva.com/22747/1018594-22747512.pdf?src-supplier=Element14; ComponentLink6Description: https://datasheet.ciiva.com/22747/1018594-22747512.pdf?src-supplier=Element14; ComponentLink7URL: https://datasheet.ciiva.com/12667/pyu-rc0402-51-rohs-l-6-r-12667067.pdf?src-supplier=Mouser; ComponentLink7Description: https://datasheet.ciiva.com/12667/pyu-rc0402-51-rohs-l-6-r-12667067.pdf?src-supplier=Mouser
R5 = NCP15XH103F03RC: THERMISTOR NTC 10KOHM 3380K 0402; Manufacturer: Murata; Tolerance: 1%; Value: 10kR; Power Rating: 100mW; Current Rating: 310uA; Supplier 1: Digi-Key; Supplier Part Number 1: 490-4801-1-ND; Manufacturer Part Number: NCP15XH103F03RC; RoHS: Yes; Category: Thermistors; Stock 1: 408773; Pricing 1: 1=0.14000, 5=0.13000, 10=0.11600, 25=0.10360, 50=0.09120, 100=0.07770, 500=0.06428, 1000=0.05381, 5000=0.04783 (USD); Mounting Technology: Surface Mount; Case/Package: 0402; Pins: 2; Case Code (Metric): 1005; Case Code (Imperial): 0402; Min Operating Temperature: -40°C; Max Operating Temperature: 125°C; Packaging: Tape and Reel; Package Quantity: 1; Max Power Dissipation: 100mW; Termination: SMD/SMT; Series: NCP; Resistance Tolerance: 1%; Length: 1mm; Height: 0.5mm; Depth: 0.5mm; Radiation Hardening: No; Reach SVHC Compliant: Yes; Lead Free: Lead Free; RoHS Compliant: Yes; ComponentLink1URL: https://datasheet.ciiva.com/2848/r44e-2848224.pdf?src-supplier=Digi-Key; ComponentLink1Description: https://datasheet.ciiva.com/2848/r44e-2848224.pdf?src-supplier=Digi-Key; ComponentLink2URL: https://datasheet.ciiva.com/2848/r44e-2848223.pdf?src-supplier=Digi-Key; ComponentLink2Description: https://datasheet.ciiva.com/2848/r44e-2848223.pdf?src-supplier=Digi-Key; ComponentLink3URL: https://datasheet.ciiva.com/2848/r44e-2848225.pdf?src-supplier=Digi-Key; ComponentLink3Description: https://datasheet.ciiva.com/2848/r44e-2848225.pdf?src-supplier=Digi-Key; ComponentLink4URL: https://datasheet.ciiva.com/3280/l0770e-3280495.pdf?src-supplier=Avnet; ComponentLink4Description: https://datasheet.ciiva.com/3280/l0770e-3280495.pdf?src-supplier=Avnet; ComponentLink5URL: https://datasheet.ciiva.com/16208/ncp15wb473j03rc-16208150.pdf?src-supplier=Future+Electronics; ComponentLink5Description: https://datasheet.ciiva.com/16208/ncp15wb473j03rc-16208150.pdf?src-supplier=Future+Electronics
R6 = RC0402FR-07360KL: RES SMD 360K OHM 1% 1/16W 0402; Manufacturer: Yageo; Value: 360kR; Temperature Coefficient: 100ppm/°C; Power Rating: 62.5mW; Voltage Rating: 50V; Max Power Dissipation: 63mW; Supplier 1: Digi-Key; Supplier Part Number 1: 311-360KLRCT-ND; Manufacturer Part Number: RC0402FR-07360KL; RoHS: Yes; Category: Chip SMD Resistors; Stock 1: 662020; Pricing 1: 1=0.10000, 10=0.01400, 100=0.00580, 1000=0.00262, 2500=0.00228, 5000=0.00188 (USD); Case/Package: 0402; Contact Plating: Tin,Matte; Case Code (Metric): 1005; Case Code (Imperial): 0402; Min Operating Temperature: -55°C; Max Operating Temperature: 155°C; Tolerance: 1%; Resistor Type: Thick Film; Packaging: Tape and Reel; Package Quantity: 1; Number of Terminations: 2; Termination: SMD/SMT; Voltage Rating (DC): 50V; Features: Moisture Resistant; Series: RC; Construction: Rectangular; Resistance Tolerance: 1%; Length: 1mm; Width: 0.02inch; Height: 0.016inch; Depth: 0.5mm; Military Standard: Not; Lead Free: Lead Free; RoHS Compliant: Yes; ComponentLink1URL: https://datasheet.ciiva.com/2453/pyu-r-int-thick-7-2453620.pdf?src-supplier=Digi-Key; ComponentLink1Description: https://datasheet.ciiva.com/2453/pyu-r-int-thick-7-2453620.pdf?src-supplier=Digi-Key; ComponentLink2URL: https://datasheet.ciiva.com/2453/pyu-r-int-thick-7-2453621.pdf?src-supplier=Digi-Key; ComponentLink2Description: https://datasheet.ciiva.com/2453/pyu-r-int-thick-7-2453621.pdf?src-supplier=Digi-Key; ComponentLink3URL: https://datasheet.ciiva.com/2453/pyu-r-int-thick-7-2453619.pdf?src-supplier=Digi-Key; ComponentLink3Description: https://datasheet.ciiva.com/2453/pyu-r-int-thick-7-2453619.pdf?src-supplier=Digi-Key; ComponentLink4URL: https://datasheet.ciiva.com/12561/pyu-rc0402-51-rohs-l-6-r-8721-12561150.pdf?src-supplier=Mouser; ComponentLink4Description: https://datasheet.ciiva.com/12561/pyu-rc0402-51-rohs-l-6-r-8721-12561150.pdf?src-supplier=Mouser; ComponentLink5URL: https://datasheet.ciiva.com/8886/pyu-rc0402-51-rohs-l-6-8886029.pdf?src-supplier=Avnet; ComponentLink5Description: https://datasheet.ciiva.com/8886/pyu-rc0402-51-rohs-l-6-8886029.pdf?src-supplier=Avnet; ComponentLink6URL: https://datasheet.ciiva.com/16742/pyu-rc0402-51-rohs-l-6-r-16742217.pdf?src-supplier=Future+Electronics; ComponentLink6Description: https://datasheet.ciiva.com/16742/pyu-rc0402-51-rohs-l-6-r-16742217.pdf?src-supplier=Future+Electronics
R8 = RC0402FR-0756KL: RES SMD 56K OHM 1% 1/16W 0402; Manufacturer: Yageo; Power Rating: 62.5mW; Temperature Coefficient: 100ppm/°C; Resistance: 56kR; Voltage Rating: 50V; Max Power Dissipation: 63mW; Supplier 1: Digi-Key; Supplier Part Number 1: 311-56.0KLRCT-ND; Manufacturer Part Number: RC0402FR-0756KL; RoHS: Yes; Category: Chip SMD Resistors; Stock 1: 724545; Pricing 1: 1=0.10000, 10=0.01600, 100=0.00660, 1000=0.00299, 2500=0.00259, 5000=0.00214 (USD); Case/Package: 0402; Case Code (Metric): 1005; Case Code (Imperial): 0402; Min Operating Temperature: -55°C; Max Operating Temperature: 155°C; Tolerance: 1%; Series: RC; Technology: THICK FILM; Package Quantity: 1; Packaging: Tape and Reel; Resistor Type: Thick Film; Number of Terminations: 2; Termination: SMD/SMT; Working Voltage: 50V; Features: Moisture Resistant; Construction: Rectangular; Resistance Tolerance: 1%; Length: 1mm; Width: 0.02inch; Height: 0.016inch; Depth: 0.5mm; RoHS Compliant: Yes; REACH SVHC: No SVHC; Military Standard: Not; Lead Free: Lead Free; ComponentLink1URL: https://datasheet.ciiva.com/46412/1018594-46412840.pdf?src-supplier=Element14; ComponentLink1Description: https://datasheet.ciiva.com/46412/1018594-46412840.pdf?src-supplier=Element14; ComponentLink2URL: https://datasheet.ciiva.com/2453/pyu-r-int-thick-7-2453479.pdf?src-supplier=Digi-Key; ComponentLink2Description: https://datasheet.ciiva.com/2453/pyu-r-int-thick-7-2453479.pdf?src-supplier=Digi-Key; ComponentLink3URL: https://datasheet.ciiva.com/2453/pyu-r-int-thick-7-2453480.pdf?src-supplier=Digi-Key; ComponentLink3Description: https://datasheet.ciiva.com/2453/pyu-r-int-thick-7-2453480.pdf?src-supplier=Digi-Key; ComponentLink4URL: https://datasheet.ciiva.com/2453/pyu-r-int-thick-7-2453478.pdf?src-supplier=Digi-Key; ComponentLink4Description: https://datasheet.ciiva.com/2453/pyu-r-int-thick-7-2453478.pdf?src-supplier=Digi-Key; ComponentLink5URL: https://datasheet.ciiva.com/5558/pyu-rc0402-51-rohs-l-6-r-5558279.pdf?src-supplier=Mouser; ComponentLink5Description: https://datasheet.ciiva.com/5558/pyu-rc0402-51-rohs-l-6-r-5558279.pdf?src-supplier=Mouser; ComponentLink6URL: https://datasheet.ciiva.com/7850/1018594-7850045.pdf?src-supplier=Element14; ComponentLink6Description: https://datasheet.ciiva.com/7850/1018594-7850045.pdf?src-supplier=Element14; ComponentLink7URL: https://datasheet.ciiva.com/7850/1018594-7850044.pdf?src-supplier=Element14; ComponentLink7Description: https://datasheet.ciiva.com/7850/1018594-7850044.pdf?src-supplier=Element14
R12 = RC0402FR-07510RL: RES SMD 510 OHM 1% 1/16W 0402; Manufacturer 1: Yageo; Voltage Rating (DC): 50V; Power Rating: 63mW; Temperature Coefficient: 100ppm/°C; Category 1: Resistors; Category 2: Chip Resistor - Surface Mount; Supplier 1: Digi-Key; Manufacturer Part Number 1: RC0402FR-07510RL; Stock 1: 458379; Pricing 1: 1=0.10000, 10=0.01600, 100=0.00640, 1000=0.00289, 2500=0.00251, 5000=0.00207 (USD); RoHS: Yes; Case/Package: 0402; Weight: 2.3E-05oz; Case Code (Imperial): 0402; Case Code (Metric): 1005; Min Operating Temperature: -55°C; Max Operating Temperature: 155°C; Features: Moisture Resistant; Tolerance: 1%; Packaging: Tape and Reel; Package Quantity: 1; Termination: SMD/SMT; Composition: Thick Film; Number of Terminations: 2; Military Standard: Not; Resistance: 510R; Voltage Rating: 50V; Max Power Dissipation: 63mW; Length: 1mm; Height: 0.016inch; Depth: 0.5mm; Width: 0.5mm; Lead Free: Lead Free; REACH SVHC: Unknown; ComponentLink1URL: https://datasheet.ciiva.com/17063/pyu-rc0402-51-rohs-l-6-r-17063430.pdf?src-supplier=Future+Electronics; ComponentLink1Description: https://datasheet.ciiva.com/17063/pyu-rc0402-51-rohs-l-6-r-17063430.pdf?src-supplier=Future+Electronics; ComponentLink2URL: https://datasheet.ciiva.com/2453/pyu-r-int-thick-7-2453397.pdf?src-supplier=Digi-Key; ComponentLink2Description: https://datasheet.ciiva.com/2453/pyu-r-int-thick-7-2453397.pdf?src-supplier=Digi-Key; ComponentLink3URL: https://datasheet.ciiva.com/2453/pyu-r-int-thick-7-2453398.pdf?src-supplier=Digi-Key; ComponentLink3Description: https://datasheet.ciiva.com/2453/pyu-r-int-thick-7-2453398.pdf?src-supplier=Digi-Key; ComponentLink4URL: https://datasheet.ciiva.com/2453/pyu-r-int-thick-7-2453399.pdf?src-supplier=Digi-Key; ComponentLink4Description: https://datasheet.ciiva.com/2453/pyu-r-int-thick-7-2453399.pdf?src-supplier=Digi-Key; Supplier Part Number 1: 311-510LRCT-ND; Mount: Surface Mount; Manufacturer: Yageo; Manufacturer Part Number: RC0402FR-07510RL
SW1 SW2 = PTS810SJM250SMTRLFS: SWITCH TACTILE SPST-NO 0.05A 16V; Manufacturer: ITT C&K; Mechanical Life: 150000Cycles; Operating Force: 160gf; Throw Configuration: SPST; Current Rating: 50mA; Illumination Type: Non-Illuminated; Switch Travel: 0.15mm; Switch Function: Off-Mom; Actuator Type: Standard; Supplier 1: Digi-Key; Supplier Part Number 1: CKN10502CT-ND; Manufacturer Part Number: PTS810SJM250SMTRLFS; RoHS: Yes; Category: Tactile Switches; Stock 1: 536224; Pricing 1: 1=0.36000, 10=0.34400, 25=0.32440, 100=0.28150, 250=0.25536, 500=0.23754, 1000=0.21379 (USD); Mount: Surface Mount; Case/Package: SMD/SMT; Color: Black; Contact Plating: Silver; Min Operating Temperature: -40°C; Max Operating Temperature: 85°C; Packaging: Tape and Reel; Termination: J-Bend; Voltage Rating (DC): 16V; Package Quantity: 2900; Max Current Rating: 50mA; Orientation: Straight; Length: 3.2mm; Depth: 4.6mm; Lead Free: Lead Free; RoHS Compliant: Yes; ComponentLink1URL: https://datasheet.ciiva.com/24082/pts810-4mar13-248115-24082262.pdf?src-supplier=Mouser; ComponentLink1Description: https://datasheet.ciiva.com/24082/pts810-4mar13-248115-24082262.pdf?src-supplier=Mouser; ComponentLink2URL: https://datasheet.ciiva.com/18514/pts810-4mar13-18514059.pdf?src-supplier=Digi-Key; ComponentLink2Description: https://datasheet.ciiva.com/18514/pts810-4mar13-18514059.pdf?src-supplier=Digi-Key; ComponentLink3URL: https://datasheet.ciiva.com/18514/pts810-4mar13-18514060.pdf?src-supplier=Digi-Key; ComponentLink3Description: https://datasheet.ciiva.com/18514/pts810-4mar13-18514060.pdf?src-supplier=Digi-Key; ComponentLink4URL: https://datasheet.ciiva.com/18514/pts810-4mar13-18514058.pdf?src-supplier=Digi-Key; ComponentLink4Description: https://datasheet.ciiva.com/18514/pts810-4mar13-18514058.pdf?src-supplier=Digi-Key
U1 = BQ25180YBGR: IC 1-A LI-ION IC PROGRAMMABLE CHARG; Manufacturer: Texas Instruments; Supplier 1: Digi-Key; Supplier Part Number 1: 296-BQ25180YBGRCT-ND; Manufacturer Part Number: BQ25180YBGR; RoHS: No; Stock 1: 5326; Pricing 1: 1=2.78000, 10=2.50000, 25=2.35840, 100=2.00940, 250=1.88680, 500=1.65096, 1000=1.42400 (USD); ComponentLink1Description: https://www.ti.com/lit/ds/symlink/bq25180.pdf?ts=1664107697804&ref_url=https%253A%252F%252Fwww.ti.com%252Fproduct%252FBQ25180; ComponentLink1URL: https://www.ti.com/lit/ds/symlink/bq25180.pdf?ts=1664107697804&ref_url=https%253A%252F%252Fwww.ti.com%252Fproduct%252FBQ25180
U2 = 74LVC4066BQ,115: IC SWITCH QUAD SPST 14DHVQFN; Manufacturer: Nexperia; Supplier 1: Digi-Key; Supplier Part Number 1: 1727-3499-1-ND; Manufacturer Part Number: 74LVC4066BQ,115; RoHS: Yes; Category: Decoders and Multiplexers; Stock 1: 53790; Pricing 1: 1=0.67000, 10=0.59300, 25=0.55720, 100=0.45480, 250=0.42248, 500=0.35956, 1000=0.28764 (USD); RoHS Compliant: Yes; ComponentLink1URL: https://assets.nexperia.com/documents/data-sheet/74LVC4066.pdf?src-supplier=Digi-Key; ComponentLink1Description: https://assets.nexperia.com/documents/data-sheet/74LVC4066.pdf?src-supplier=Digi-Key
U3 = NCP167BMX330TBG: IC REG LINEAR 3.3V 700MA 4XDFN; Manufacturer: ON Semiconductor; Supplier 1: Digi-Key; Supplier Part Number 1: NCP167BMX330TBGOSCT-ND; Manufacturer Part Number: NCP167BMX330TBG; RoHS: Yes; Category: Voltage Regulators - Linear; Stock 1: 222045; Pricing 1: 1=0.61000, 10=0.52500, 25=0.49000, 100=0.39210, 250=0.36408, 500=0.30806, 1000=0.23804 (USD); RoHS Compliant: Yes; ComponentLink1URL: http://www.farnell.com/datasheets/2711391.pdf?src-supplier=Farnell; ComponentLink1Description: http://www.farnell.com/datasheets/2711391.pdf?src-supplier=Farnell; ComponentLink2URL: https://www.onsemi.com/pub/Collateral/NCP167-D.PDF?src-supplier=Digi-Key; ComponentLink2Description: https://www.onsemi.com/pub/Collateral/NCP167-D.PDF?src-supplier=Digi-Key; ComponentLink3URL: http://www.farnell.com/datasheets/2711391.pdf?src-supplier=Newark; ComponentLink3Description: http://www.farnell.com/datasheets/2711391.pdf?src-supplier=Newark
U4 = STM32G473CEU6: IC MCU 32BIT 512KB FLSH 48UFQFPN; Manufacturer: STMicroelectronics; Supplier 1: Digi-Key; Supplier Part Number 1: STM32G473CEU6-ND; Manufacturer Part Number: STM32G473CEU6; RoHS: Yes; Category: Microcontrollers; Stock 1: 305; Pricing 1: 1=11.14000, 10=10.06100, 25=9.59360, 80=8.32988, 230=7.95552, 440=7.25359, 1560=6.38145 (USD)
U5 = MX25R1635FZUIL0: IC FLASH 16MBIT SPI/QUAD 8USON; Manufacturer: Macronix; Memory Type: Non-Volatile,FLASH; Memory Size: 16Mb; Frequency: 33MHz; Supplier 1: Digi-Key; Supplier Part Number 1: 1092-1204-2-ND; Manufacturer Part Number: MX25R1635FZUIL0; RoHS: Yes; Category: Memory; Stock 1: 217224; Pricing 1: 12000=0.58880 (USD); Mount: Surface Mount; Min Operating Temperature: -40°C; Max Operating Temperature: 85°C; Packaging: Tape and Reel; RoHS Compliant: Yes; Lead Free: Lead Free; ComponentLink1URL: http://ckassoc.com/oldsite/pdf/Macronix_Product_Line_Card_July_2017_General%20_070617.pdf?src-supplier=Digi-Key; ComponentLink1Description: http://ckassoc.com/oldsite/pdf/Macronix_Product_Line_Card_July_2017_General%20_070617.pdf?src-supplier=Digi-Key
X1 = Q22FA1280002500: CRYSTAL 32.0000MHZ 8PF SMD; Manufacturer: Seiko; Supplier 1: LCSC; Supplier Part Number 1: C187794; Manufacturer Part Number: Q22FA1280002500; RoHS: No; Stock 1: 25980; Pricing 1: 5=0.17610, 50=0.14280, 150=0.12660, 500=0.11100, 3000=0.10720, 6000=0.10480 (USD)
J2 J3 = Double_Header_1x11_2.54: Manufacturer: *; Manufacturer Part Number: *; Category: *; Supplier 1: *; Supplier Unit Price 1: *; Supplier Currency 1: *
J4 = Double_Header_1x3_2.54: Manufacturer: *; Manufacturer Part Number: *; Category: *; Supplier 1: *; Supplier Unit Price 1: *; Supplier Currency 1: *

## Assembly variants
001: all parts fitted